# Altium schematic sheet Battery-Management.SchDoc
size A2; Organization: Altium Limited; Address1: L3, 12a Rodborough Rd; Address2: Frenchs Forest; Address3: NSW; Address4: Australia 2086
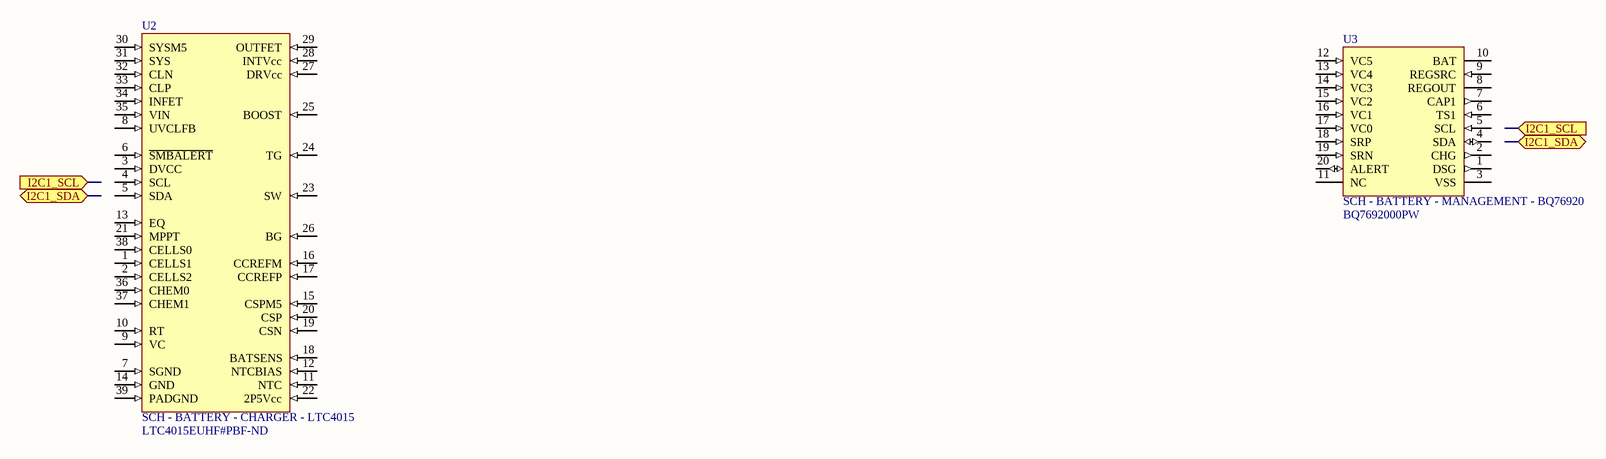
[diagram p0: Battery-Management.SchDoc]

## Parts
U2  SCH - BATTERY - CHARGER - LTC4015  Supplier Part Number 1: LTC4015EUHF#PBF-ND  [PCB - LEADLESS - QFN - Analog 38-WFQFN]
U3  SCH - BATTERY - MANAGEMENT - BQ76920  Supplier Part Number 1: BQ7692000PW  [PCB - LEADS - SOP - TI 20-TSSOP]

## Ports
I2C1_SCL (in), I2C1_SDA (bidir)

## Nets

Not connected (* = marked no-connect by the designer): U2 1(CELLS1) 2(CELLS2) 3(DVCC) 4(SCL) 5(SDA) 6(~{SMBALERT}) 7(SGND) 8(UVCLFB) 9(VC) 10(RT) 11(NTC) 12(NTCBIAS) 13(EQ) 14(GND) 15(CSPM5) 16(CCREFM) 17(CCREFP) 18(BATSENS) 19(CSN) 20(CSP) 21(MPPT) 22(2P5Vcc) 23(SW) 24(TG) 25(BOOST) 26(BG) 27(DRVcc) 28(INTVcc) 29(OUTFET) 30(SYSM5) 31(SYS) 32(CLN) 33(CLP) 34(INFET) 35(VIN) 36(CHEM0) 37(CHEM1) 38(CELLS0) 39(PADGND); U3 1(DSG) 2(CHG) 3(VSS) 4(SDA) 5(SCL) 6(TS1) 7(CAP1) 8(REGOUT) 9(REGSRC) 10(BAT) 11(NC) 12(VC5) 13(VC4) 14(VC3) 15(VC2) 16(VC1) 17(VC0) 18(SRP) 19(SRN) 20(ALERT)

## Notes on the sheet
- Title
- Size:
- Date:
- File:
- A2
- Number:
- Time:
- Revision:
- Sheet
- of

## Library data of the parts
U2 = SCH - BATTERY - CHARGER - LTC4015: Supplier 1: Digi-Key
U3 = SCH - BATTERY - MANAGEMENT - BQ76920: Supplier 1: Rochester Electronics